# Altium schematic sheet jtag.SchDoc: MCB | JTAG - crystal - PS bypassing
size A4; DrawnBy: James Buckley; DocumentNumber: 3; SheetNumber: 3; SheetTotal: 12
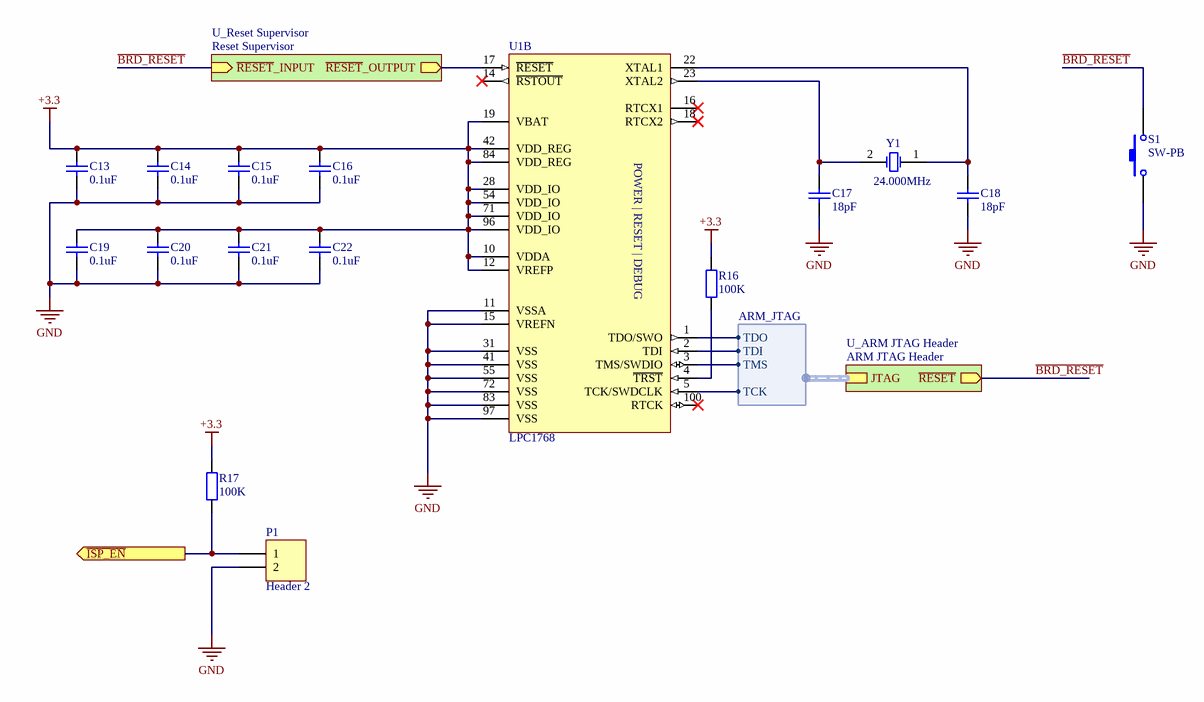
[diagram p0: jtag.SchDoc]

## Parts
C13  value 0.1uF  [C0603]  (hidden comment: Cap)
C14  value 0.1uF  [C0603]  (hidden comment: Cap)
C15  value 0.1uF  [C0603]  (hidden comment: Cap)
C16  value 0.1uF  [C0603]  (hidden comment: Cap)
C17  value 18pF  [C0603]  (hidden comment: Cap)
C18  value 18pF  [C0603]  (hidden comment: Cap)
C19  value 0.1uF  [C0603]  (hidden comment: Cap)
C20  value 0.1uF  [C0603]  (hidden comment: Cap)
C21  value 0.1uF  [C0603]  (hidden comment: Cap)
C22  value 0.1uF  [C0603]  (hidden comment: Cap)
P1  Header 2  [HDR1X2]
R16  value 100K  [R0603]  (hidden comment: Res)
R17  value 100K  [R0603]  (hidden comment: Res)
S1  SW-PB  [DTSM-32S-B]
U1  LPC1768  [LPC1768]  (part B of 3)
Y1  value 24.000MHz  [C3E-24.000-12-3030-X]  (hidden comment: XTAL)

## Sub-sheets
U_ARM JTAG Header = ARM JTAG Header: JTAG (harness ARM_JTAG), ~{RESET} (out)
U_Reset Supervisor = Reset Supervisor: ~{RESET}_OUTPUT (out), ~{RESET}_INPUT (in)

## Ports
~{ISP_EN} (out)

## Harnesses
ARM_JTAG: TCK, TDI, TDO, TMS

## Nets
+3.3: C13.1 C14.1 C15.1 C16.1 C19.1 C20.1 C21.1 C22.1 R16.2 R17.2 U1.10(VDDA) U1.12(VREFP) U1.19(VBAT) U1.28(VDD_IO) U1.42(VDD_REG) U1.54(VDD_IO) U1.71(VDD_IO) U1.84(VDD_REG) U1.96(VDD_IO)
GND: C13.2 C14.2 C15.2 C16.2 C17.2 C18.2 C19.2 C20.2 C21.2 C22.2 P1.2 S1.1 U1.11(VSSA) U1.15(VREFN) U1.31(VSS) U1.41(VSS) U1.55(VSS) U1.72(VSS) U1.83(VSS) U1.97(VSS)
~{BRD_RESET}: S1.2 ; sheet U_Reset Supervisor/~{RESET}_INPUT, sheet U_ARM JTAG Header/~{RESET}
~{ISP_EN}: P1.1 R17.1 ; port ~{ISP_EN}
NetC17_1: C17.1 U1.23(XTAL2) Y1.2(OSC2)
NetC18_1: C18.1 U1.22(XTAL1) Y1.1(OSC1)
NetR16_1: R16.1 U1.4(~{TRST})
NetU1_1: U1.1(TDO/SWO) ; sheet U_ARM JTAG Header/JTAG.TDO
NetU1_2: U1.2(TDI) ; sheet U_ARM JTAG Header/JTAG.TDI
NetU1_3: U1.3(TMS/SWDIO) ; sheet U_ARM JTAG Header/JTAG.TMS
NetU1_5: U1.5(TCK/SWDCLK) ; sheet U_ARM JTAG Header/JTAG.TCK
NetU1_17: U1.17(~{RESET}) ; sheet U_Reset Supervisor/~{RESET}_OUTPUT

Not connected (* = marked no-connect by the designer): U1 14(~{RSTOUT})* 16(RTCX1)* 18(RTCX2)* 100(RTCK)*

## Notes on the sheet
- (in symbol LPC1768, part B) POWER | RESET | DEBUG

## Library data of the parts
C13-C22 = Cap: Capacitor
  C13-C16 C19-C22: farnell: 1759122
  C17 C18: farnell: 1759056
P1 = Header 2: Header, 2-Pin; LatestRevisionDate: 17-Jul-2002; LatestRevisionNote: Re-released for DXP Platform.; Publisher: Altium Limited
R16 R17 = Res2: Resistor; farnell: 9330402
S1 = SW-PB: Switch; Published: 24-Mar-1999; LatestRevisionDate: 17-Jul-2002; LatestRevisionNote: Re-released for DXP Platform.; PackageReference: SPST-2; Publisher: Altium Limited; farnell: 9471898
Y1 = XTAL: Crystal Oscillator; farnell: 1538861
U1 = LPC1768: farnell: 1718549